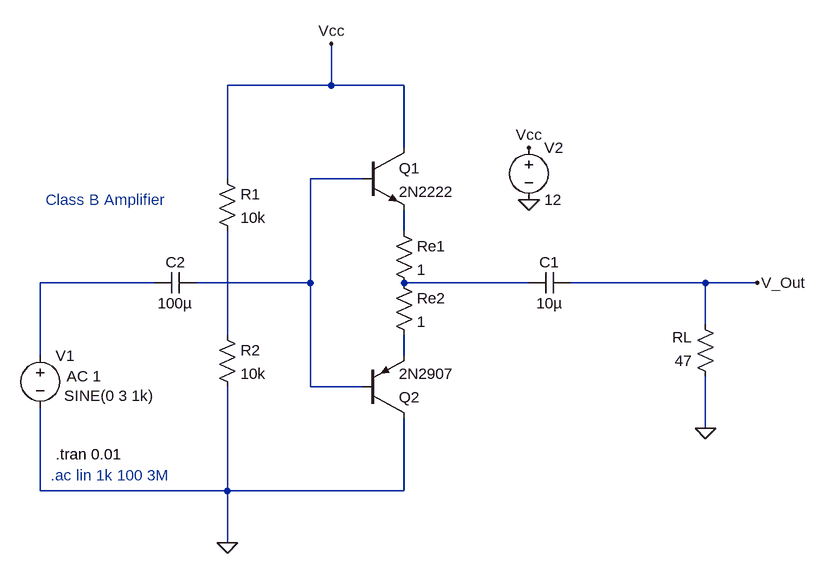
[diagram p0: schematic Class_B_Amplifier.asc]
Class_B_Amplifier.asc, the LTspice schematic file:
Version 4.1
SHEET 1 880 680
WIRE 128 -96 128 -160
WIRE 128 -96 -32 -96
WIRE 240 -96 128 -96
WIRE 240 0 240 -96
WIRE -32 48 -32 -96
WIRE 176 48 96 48
WIRE 240 128 240 96
WIRE -144 208 -320 208
WIRE 96 208 96 48
WIRE 96 208 -80 208
WIRE 432 208 240 208
WIRE 704 208 496 208
WIRE 784 208 704 208
WIRE 704 272 704 208
WIRE -32 288 -32 128
WIRE -320 320 -320 208
WIRE 240 320 240 288
WIRE 96 368 96 208
WIRE 176 368 96 368
WIRE 704 432 704 352
WIRE -320 528 -320 400
WIRE -32 528 -32 368
WIRE -32 528 -320 528
WIRE 240 528 240 416
WIRE 240 528 -32 528
WIRE -32 608 -32 528
FLAG 432 0 Vcc
FLAG 432 80 0
FLAG 704 432 0
FLAG 128 -160 Vcc
FLAG 784 208 V_Out
FLAG -32 608 0
SYMBOL npn 176 0 R0
SYMATTR InstName Q1
SYMATTR Value 2N2222
SYMBOL pnp 176 416 M180
SYMATTR InstName Q2
SYMATTR Value 2N2907
SYMBOL voltage 432 -16 R0
WINDOW 123 0 0 Left 0
WINDOW 39 0 0 Left 0
SYMATTR InstName V2
SYMATTR Value 12
SYMBOL res 720 368 R180
WINDOW 0 36 76 Left 2
WINDOW 3 36 40 Left 2
SYMATTR InstName RL
SYMATTR Value 47
SYMBOL res 224 112 R0
SYMATTR InstName Re1
SYMATTR Value 1
SYMBOL res 224 192 R0
SYMATTR InstName Re2
SYMATTR Value 1
SYMBOL cap 496 192 R90
WINDOW 0 0 32 VBottom 2
WINDOW 3 32 32 VTop 2
SYMATTR InstName C1
SYMATTR Value 10µ
SYMBOL voltage -320 304 R0
WINDOW 3 37 78 Left 2
WINDOW 123 41 48 Left 2
WINDOW 39 0 0 Left 0
SYMATTR InstName V1
SYMATTR Value SINE(0 3 1k)
SYMATTR Value2 AC 1
SYMBOL cap -80 192 R90
WINDOW 0 0 32 VBottom 2
WINDOW 3 32 32 VTop 2
SYMATTR InstName C2
SYMATTR Value 100µ
SYMBOL res -48 32 R0
SYMATTR InstName R1
SYMATTR Value 10k
SYMBOL res -48 272 R0
SYMATTR InstName R2
SYMATTR Value 10k
TEXT -296 472 Left 2 !.tran 0.01
TEXT -304 504 Left 2 ;.ac lin 1k 100 3M
TEXT -312 80 Left 2 ;Class B Amplifier

The netlist it stands for:
* Class_B_Amplifier.asc
Q1 Vcc N001 N002 0 2N2222
Q2 0 N001 N006 0 2N2907
V2 Vcc 0 12
RL 0 V_Out 47
Re1 N002 N004 1
Re2 N004 N006 1
C1 V_Out N004 10µ
V1 N003 0 SINE(0 3 1k) AC 1
C2 N001 N003 100µ
R1 Vcc N005 10k
R2 N005 0 10k
.model NPN NPN
.model PNP PNP
.lib standard.bjt
.tran 0.01
* .ac lin 1k 100 3M
* Class B Amplifier
.backanno
.end